# Altium project ADC_ArduinoDue_Shield.PrjPcb
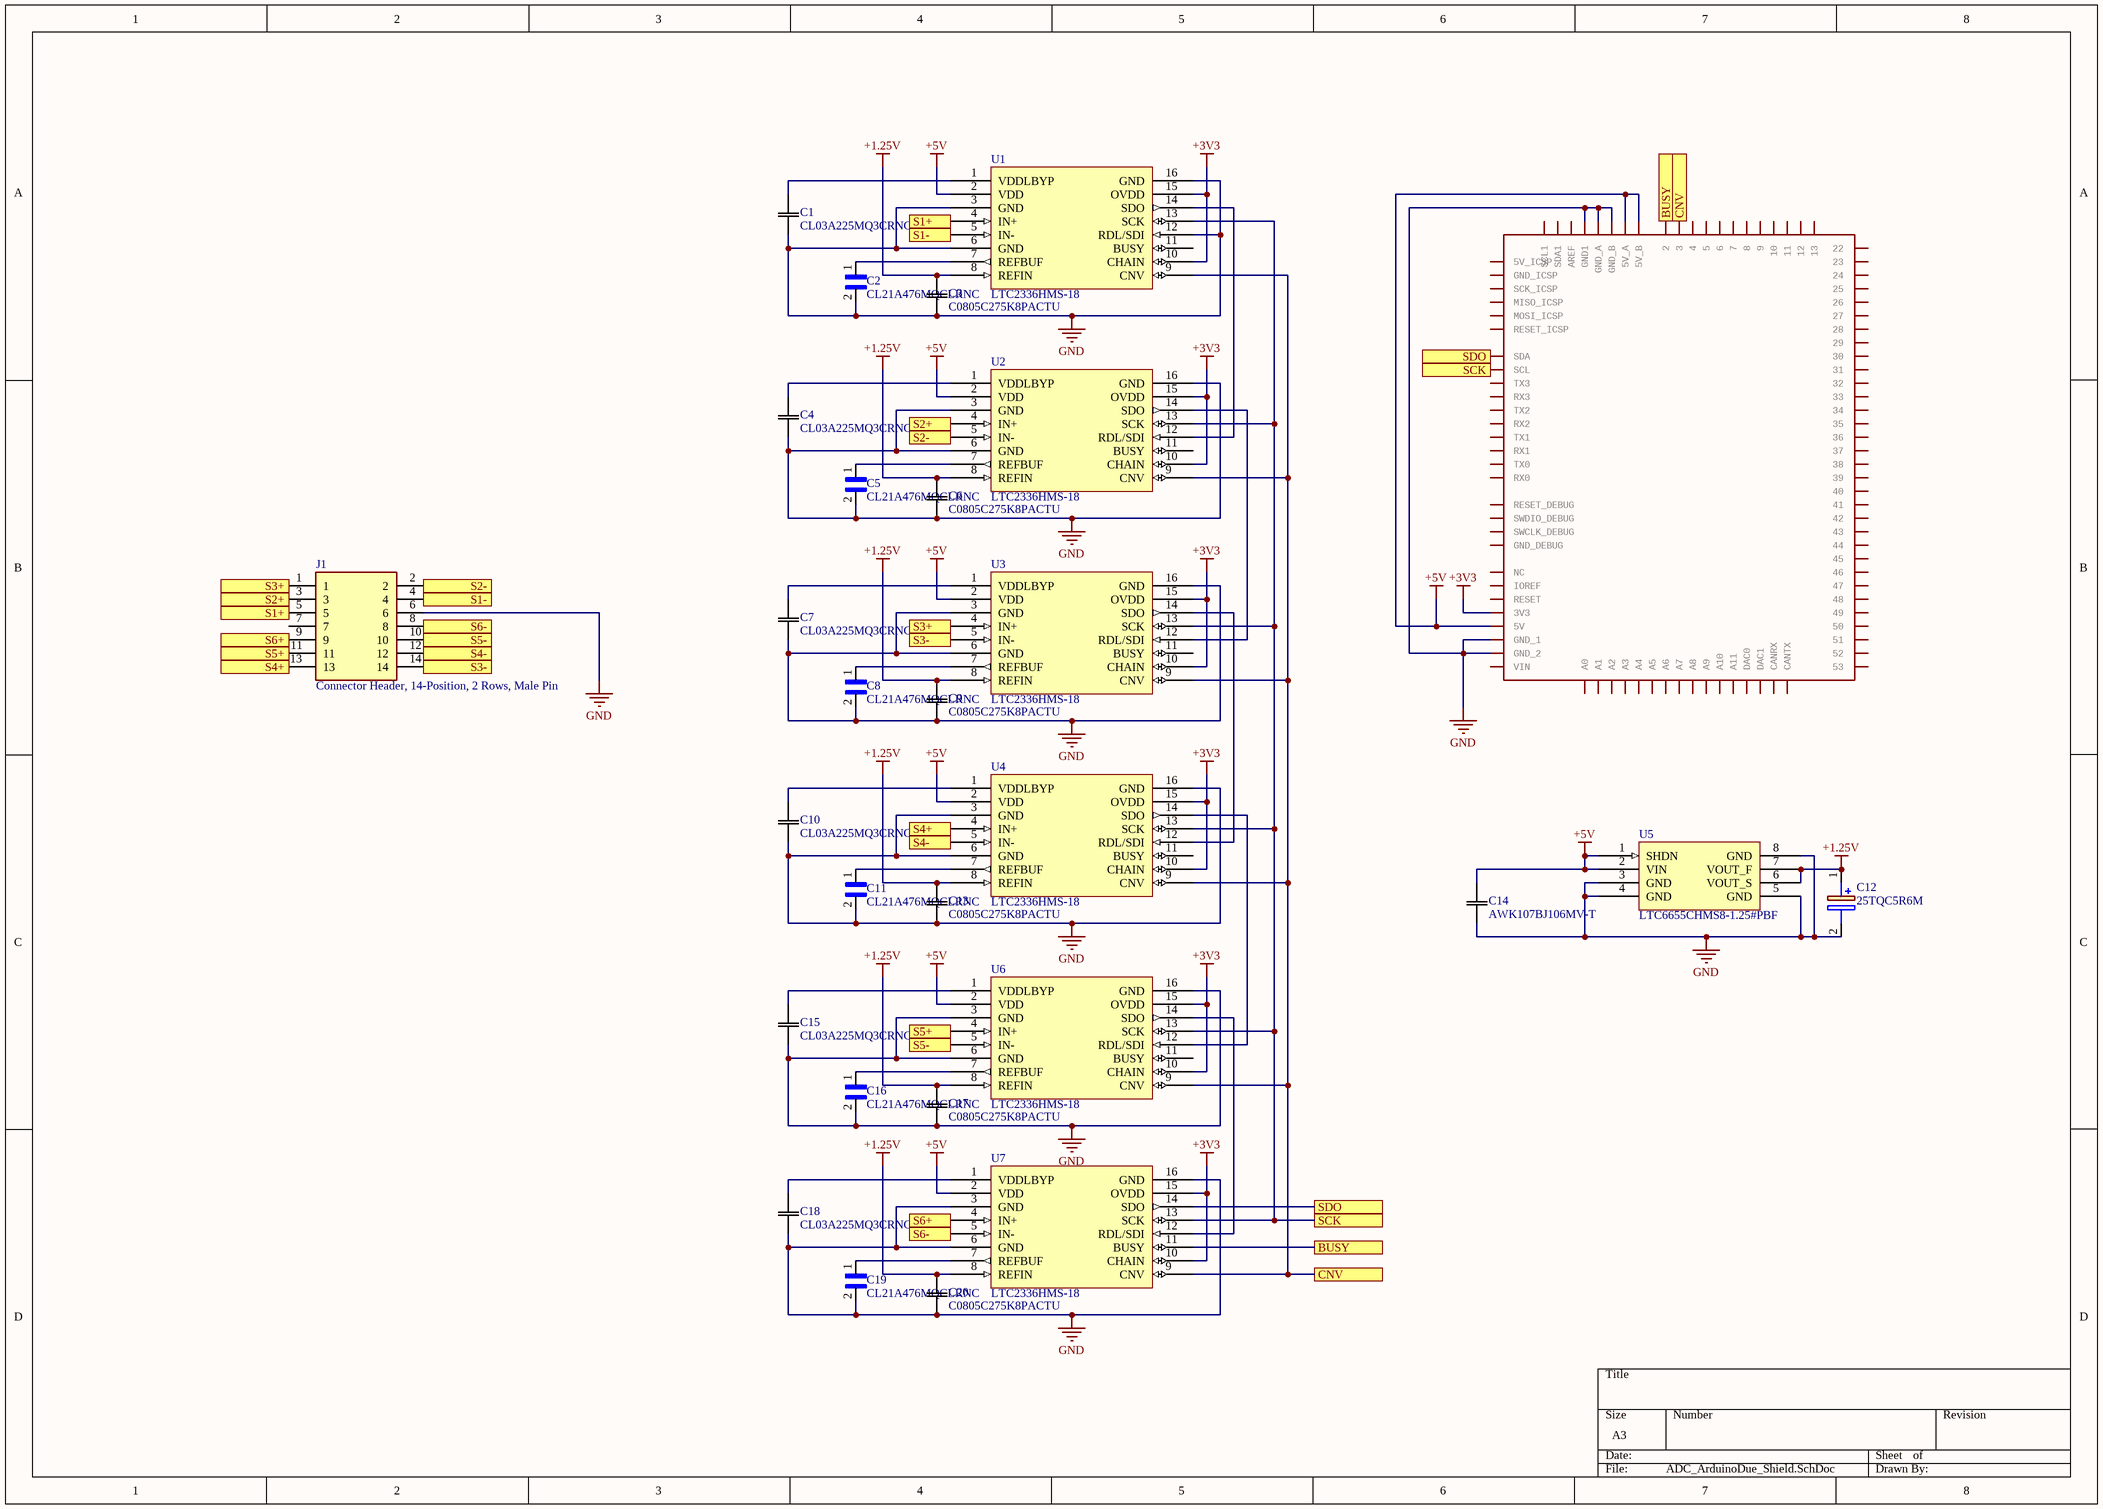
[diagram p0: ADC_ArduinoDue_Shield.SchDoc]
1 sheet, 29 parts. Net scope: flat (ports and power ports of the same name join across sheets).
Board file: ADC_ArduinoDue_Shield.PcbDoc

## Sheet ADC_ArduinoDue_Shield.SchDoc
size A3; SheetNumber: 1; SheetTotal: 1

### Parts
C1  CL03A225MQ3CRNC  [CAP_CL_03_SAM]
C2  CL21A476MQCLRNC  [CAPC2012X140N]
C3  C0805C275K8PACTU  [CAPC220145_105N_KEM]
C4  CL03A225MQ3CRNC  [CAP_CL_03_SAM]
C5  CL21A476MQCLRNC  [CAPC2012X140N]
C6  C0805C275K8PACTU  [CAPC220145_105N_KEM]
C7  CL03A225MQ3CRNC  [CAP_CL_03_SAM]
C8  CL21A476MQCLRNC  [CAPC2012X140N]
C9  C0805C275K8PACTU  [CAPC220145_105N_KEM]
C10  CL03A225MQ3CRNC  [CAP_CL_03_SAM]
C11  CL21A476MQCLRNC  [CAPC2012X140N]
C12  25TQC5R6M  [POSCAP_B1_B1S_B1G_B15G_B2_B2S]
C13  C0805C275K8PACTU  [CAPC220145_105N_KEM]
C14  AWK107BJ106MV-T  [AWK107_0306_TAY]
C15  CL03A225MQ3CRNC  [CAP_CL_03_SAM]
C16  CL21A476MQCLRNC  [CAPC2012X140N]
C17  C0805C275K8PACTU  [CAPC220145_105N_KEM]
C18  CL03A225MQ3CRNC  [CAP_CL_03_SAM]
C19  CL21A476MQCLRNC  [CAPC2012X140N]
C20  C0805C275K8PACTU  [CAPC220145_105N_KEM]
J1  Connector Header, 14-Position, 2 Rows, Male Pin  [TE_1-770973-0]
MCU1  DUE(NORMAL)  [DUE(NORMAL)]  (value not drawn)
U1  LTC2336HMS-18  [TSSOP50P490X110-16N]
U2  LTC2336HMS-18  [TSSOP50P490X110-16N]
U3  LTC2336HMS-18  [TSSOP50P490X110-16N]
U4  LTC2336HMS-18  [TSSOP50P490X110-16N]
U5  LTC6655CHMS8-1.25#PBF  [TSOP65P490X110-8N]
U6  LTC2336HMS-18  [TSSOP50P490X110-16N]
U7  LTC2336HMS-18  [TSSOP50P490X110-16N]

### Ports
BUSY, CNV, S1+, S1-, S2+, S2-, S3+, S3-, S4+, S4-, S5+, S5-, S6+, S6-, SCK, SDO

### Nets
+1.25V: C3.2 C6.2 C9.2 C12.1(+) C13.2 C17.2 C20.2 U1.8(REFIN) U2.8(REFIN) U3.8(REFIN) U4.8(REFIN) U5.6(VOUT_S) U5.7(VOUT_F) U6.8(REFIN) U7.8(REFIN)
+3V3: MCU1.3V3 U1.10(CHAIN) U1.15(OVDD) U2.10(CHAIN) U2.15(OVDD) U3.10(CHAIN) U3.15(OVDD) U4.10(CHAIN) U4.15(OVDD) U6.10(CHAIN) U6.15(OVDD) U7.10(CHAIN) U7.15(OVDD)
+5V: C14.2 MCU1.5V MCU1.5V_A MCU1.5V_B U1.2(VDD) U2.2(VDD) U3.2(VDD) U4.2(VDD) U5.1(SHDN) U5.2(VIN) U6.2(VDD) U7.2(VDD)
GND: C1.1 C2.2 C3.1 C4.1 C5.2 C6.1 C7.1 C8.2 C9.1 C10.1 C11.2 C12.2(-) C13.1 C14.1 C15.1 C16.2 C17.1 C18.1 C19.2 C20.1 J1.6 MCU1.GND1 MCU1.GND_1 MCU1.GND_2 MCU1.GND_A MCU1.GND_B U1.3(GND) U1.6(GND) U1.12(RDL/SDI) U1.16(GND) U2.3(GND) U2.6(GND) U2.16(GND) U3.3(GND) U3.6(GND) U3.16(GND) U4.3(GND) U4.6(GND) U4.16(GND) U5.3(GND) U5.4(GND) U5.5(GND) U5.8(GND) U6.3(GND) U6.6(GND) U6.16(GND) U7.3(GND) U7.6(GND) U7.16(GND)
NetC1_2: C1.2 U1.1(VDDLBYP)
NetC2_1: C2.1 U1.7(REFBUF)
NetC4_2: C4.2 U2.1(VDDLBYP)
NetC5_1: C5.1 U2.7(REFBUF)
NetC7_2: C7.2 U3.1(VDDLBYP)
NetC8_1: C8.1 U3.7(REFBUF)
NetC10_2: C10.2 U4.1(VDDLBYP)
NetC11_1: C11.1 U4.7(REFBUF)
NetC15_2: C15.2 U6.1(VDDLBYP)
NetC16_1: C16.1 U6.7(REFBUF)
NetC18_2: C18.2 U7.1(VDDLBYP)
NetC19_1: C19.1 U7.7(REFBUF)
NetJ1_1: J1.1 U3.4(IN+) ; port S3+
NetJ1_2: J1.2 U2.5(IN-) ; port S2-
NetJ1_3: J1.3 U2.4(IN+) ; port S2+
NetJ1_4: J1.4 U1.5(IN-) ; port S1-
NetJ1_5: J1.5 U1.4(IN+) ; port S1+
NetJ1_8: J1.8 U7.5(IN-) ; port S6-
NetJ1_9: J1.9 U7.4(IN+) ; port S6+
NetJ1_10: J1.10 U6.5(IN-) ; port S5-
NetJ1_11: J1.11 U6.4(IN+) ; port S5+
NetJ1_12: J1.12 U4.5(IN-) ; port S4-
NetJ1_13: J1.13 U4.4(IN+) ; port S4+
NetJ1_14: J1.14 U3.5(IN-) ; port S3-
NetMCU1_2: MCU1.2 U7.11(BUSY) ; port BUSY
NetMCU1_3: MCU1.3 U1.9(CNV) U2.9(CNV) U3.9(CNV) U4.9(CNV) U6.9(CNV) U7.9(CNV) ; port CNV
NetMCU1_SCL: MCU1.SCL U1.13(SCK) U2.13(SCK) U3.13(SCK) U4.13(SCK) U6.13(SCK) U7.13(SCK) ; port SCK
NetMCU1_SDA: MCU1.SDA U7.14(SDO) ; port SDO
NetU1_14: U1.14(SDO) U2.12(RDL/SDI)
NetU2_14: U2.14(SDO) U3.12(RDL/SDI)
NetU3_14: U3.14(SDO) U4.12(RDL/SDI)
NetU4_14: U4.14(SDO) U6.12(RDL/SDI)
NetU6_14: U6.14(SDO) U7.12(RDL/SDI)

Not connected (* = marked no-connect by the designer): J1 7; MCU1 4 5 5V_ICSP 6 7 8 9 10 11 12 13 22 23 24 25 26 27 28 29 30 31 32 33 34 35 36 37 38 39 40 41 42 43 44 45 46 47 48 49 50 51 52 53 A0 A1 A2 A3 A4 A5 A6 A7 A8 A9 A10 A11 AREF CANRX CANTX DAC0 DAC1 GND_DEBUG GND_ICSP IOREF MISO_ICSP MOSI_ICSP NC RESET RESET_DEBUG RESET_ICSP RX0 RX1 RX2 RX3 SCK_ICSP SCL1 SDA1 SWCLK_DEBUG SWDIO_DEBUG TX0 TX1 TX2 TX3 VIN; U1 11(BUSY); U2 11(BUSY); U3 11(BUSY); U4 11(BUSY); U6 11(BUSY)

### Library data of the parts
C1 C4 C7 C10 C15 C18 = CL03A225MQ3CRNC: CL03 Series 0201 2.2 uF 6.3 V X5R ±20% Tolerance Multilayer Ceramic Capacitor; Mfr_Name: Samsung; Type: DEV; Capacitance: 2.2uF; Voltage Rating: 6.3V; Copyright: Copyright (C) 2022 Ultra Librarian. All rights reserved.; Manufacturer_Part_Number: CL03A225MQ3CRNC; Digi-Key_Part_Number_1: 1276-6870-2-ND; Digi-Key_Part_Number_2: 1276-6870-1-ND; Digi-Key_Part_Number_3: 1276-6870-6-ND; RefDes: RefDes; Supplier 1: Digi-Key; Supplier Part Number 1: 1276-6870-1-ND; Manufacturer: Samsung; Manufacturer Part Number: CL03A225MQ3CRNC; RoHS: Yes; Category: Ceramic Capacitors; Stock 1: 667406; Pricing 1: 1=0.27000, 10=0.18500, 50=0.11080, 100=0.09360, 500=0.06406, 1000=0.05667, 2500=0.05421, 5000=0.04928 (USD); Mount: Surface Mount; Case/Package: 0201; Case Code (Metric): 0603; Case Code (Imperial): 0201; Min Operating Temperature: -55°C; Max Operating Temperature: 85°C; Packaging: Tape and Reel; Tolerance: 20%; Dielectric: X5R; Series: CL; Construction: Flat; Length: 0.6mm; Width: 0.012inch; Height: 0.3mm; Thickness: 0.013inch; Depth: 0.3mm; Radiation Hardening: No; RoHS Compliant: Yes; ComponentLink1URL: https://datasheet.ciiva.com/26838/getdatasheetpartid-745303-26838096.pdf?src-supplier=Verical; ComponentLink1Description: https://datasheet.ciiva.com/26838/getdatasheetpartid-745303-26838096.pdf?src-supplier=Verical; Supplier 2: Digi-Key; Supplier Part Number 2: 1276-6870-6-ND; Stock 2: 667406; Pricing 2: 1=0.27000, 10=0.18500, 50=0.11080, 100=0.09360, 500=0.06406, 1000=0.05667, 2500=0.05421, 5000=0.04928 (USD); Supplier 3: Digi-Key; Supplier Part Number 3: 1276-6870-2-ND; Stock 3: 650000; Pricing 3: 10000=0.04682, 20000=0.04435 (USD); Supplier 4: Mouser; Supplier Part Number 4: 187-CL03A225MQ3CRNC; Stock 4: 295762; Pricing 4: 1=0.29000, 10=0.13300, 50=0.13300, 100=0.10000, 1000=0.06100, 10000=0.04900 (USD)
C2 C5 C8 C11 C16 C19 = CL21A476MQCLRNC: Cap Ceramic 47uF 6.3V X5R 20% SMD 0805 85°C Paper T/R; MF: Samsung; Package: 0805 Samsung; MP: CL21A476MQCLRNC; Value: *; SnapEDA_Link: https://www.snapeda.com/parts/CL21A476MQCLRNC/Samsung/view-part/3598165/?ref=snap; Availability: Unavailable; Price: None; DigiKey-Purchase-URL: https://snapeda.com/shop?store=DigiKey&id=3598165; Supplier 1: Digi-Key; Supplier Part Number 1: 1276-2420-1-ND; Manufacturer: Samsung; Manufacturer Part Number: CL21A476MQCLRNC; RoHS: Yes; Category: Ceramic Capacitors; Stock 1: 98057; Pricing 1: 1=0.49000, 10=0.34100, 50=0.23900, 100=0.20480, 500=0.15362, 1000=0.12973 (USD); Mount: Surface Mount; Case/Package: 0805; Case Code (Metric): 2012; Case Code (Imperial): 0805; Contact Plating: Tin; Min Operating Temperature: -55°C; Max Operating Temperature: 85°C; Tolerance: 20%; Packaging: Tape and Reel; Package Quantity: 4000; Capacitance: 47uF; Voltage Rating: 6.3V; Dielectric: X5R; Termination: Wraparound; Series: CL; Construction: Flat; Length: 2mm; Width: 0.049inch; Thickness: 0.037inch; Depth: 1.25mm; Lead Free: Lead Free; RoHS Compliant: Yes; ComponentLink1URL: https://datasheet.ciiva.com/25723/cl21a476mqclrnc-25723991.pdf?src-supplier=Digi-Key; ComponentLink1Description: https://datasheet.ciiva.com/25723/cl21a476mqclrnc-25723991.pdf?src-supplier=Digi-Key; Supplier 2: Digi-Key; Supplier Part Number 2: 1276-2420-6-ND; Stock 2: 98057; Pricing 2: 1=0.49000, 10=0.34100, 50=0.23900, 100=0.20480, 500=0.15362, 1000=0.12973 (USD); Supplier 3: Digi-Key; Supplier Part Number 3: 1276-2420-2-ND; Stock 3: 98057; Pricing 3: 4000=0.11607, 8000=0.10924 (USD); Supplier 4: Mouser; Supplier Part Number 4: 187-CL21A476MQCLRNC; Stock 4: 323; Pricing 4: 1=0.50000, 10=0.28500, 50=0.28500, 100=0.21700, 1000=0.13700, 10000=0.10800 (USD)
C3 C6 C9 C13 C17 C20 = C0805C275K8PACTU: 0805 C 2.7uF Ceramic Multilayer Capacitor; 10 VDC; +85degC; X5R Dielec; +/-10%; Mfr_Name: Kemet; Type: DEV; Tolerance: 10%; Voltage Rating: 10V; Dissipation Factor: 5%; Copyright: Copyright (C) 2022 Ultra Librarian. All rights reserved.; Manufacturer_Part_Number: C0805C275K8PACTU; Digi-Key_Part_Number_1: 399-3127-1-ND; Digi-Key_Part_Number_2: 399-3127-2-ND; Digi-Key_Part_Number_3: 399-3127-6-ND; RefDes: RefDes; Supplier 1: Digi-Key; Supplier Part Number 1: 399-C0805C275K8PAC7800CT-ND; Manufacturer: KEMET; Manufacturer Part Number: C0805C275K8PACTU; RoHS: Yes; Category: Ceramic Capacitors; Stock 1: 7603; Pricing 1: 1=0.51000, 10=0.36000, 50=0.27220, 100=0.23700, 500=0.17556, 1000=0.14923 (USD); Mount: Surface Mount,PCB; Case/Package: 0805; Case Code (Metric): 2012; Case Code (Imperial): 0805; Dielectric Material: Ceramic; Min Operating Temperature: -55°C; Max Operating Temperature: 85°C; Capacitance: 2.7uF; Dielectric: X5R; Packaging: Tape and Reel; Package Quantity: 1; Voltage Rating (DC): 10V; Termination: SMD/SMT; Voltage: 10V; Series: C; Construction: Flat; Length: 2mm; Width: 0.049inch; Height: 3mm; Depth: 1.25mm; Thickness: 0.041inch; Lead Pitch: 0.75mm; Radiation Hardening: No; REACH SVHC: No SVHC; Lead Free: Lead Free; RoHS Compliant: Yes; ComponentLink1URL: http://www.mouser.com/ds/2/212/KEM_C1006_X5R_SMD-1103249.pdf?src-supplier=Mouser; ComponentLink1Description: http://www.mouser.com/ds/2/212/KEM_C1006_X5R_SMD-1103249.pdf?src-supplier=Mouser; ComponentLink2URL: http://components.arrow.com/part/dataview/40912422S7467711N7429?src-supplier=Arrow+Electronics; ComponentLink2Description: http://components.arrow.com/part/dataview/40912422S7467711N7429?src-supplier=Arrow+Electronics; ComponentLink3URL: http://uk.rs-online.com/webdocs/13da/0900766b813da6d7.pdf?src-supplier=RSComponents; ComponentLink3Description: http://uk.rs-online.com/webdocs/13da/0900766b813da6d7.pdf?src-supplier=RSComponents; ComponentLink4URL: http://uk.rs-online.com/webdocs/13da/0900766b813da6d8.pdf?src-supplier=RSComponents; ComponentLink4Description: http://uk.rs-online.com/webdocs/13da/0900766b813da6d8.pdf?src-supplier=RSComponents; ComponentLink5URL: https://www.alliedelec.com/m/d/7f88201dbaab65c95b0b8234579261a3.pdf?src-supplier=Allied+Electronics; ComponentLink5Description: https://www.alliedelec.com/m/d/7f88201dbaab65c95b0b8234579261a3.pdf?src-supplier=Allied+Electronics; ComponentLink6URL: https://www.alliedelec.com/m/d/fc0aaf5de6140bfa85cbf42aaccfae41.pdf?src-supplier=Allied+Electronics; ComponentLink6Description: https://www.alliedelec.com/m/d/fc0aaf5de6140bfa85cbf42aaccfae41.pdf?src-supplier=Allied+Electronics; ComponentLink7URL: https://search.kemet.com/component-edge/download/datasheet/C0805C275K8PACTU.pdf?src-supplier=Digi-Key; ComponentLink7Description: https://search.kemet.com/component-edge/download/datasheet/C0805C275K8PACTU.pdf?src-supplier=Digi-Key; ComponentLink8URL: https://api.kemet.com/component-edge/download/datasheet/C0805C275K8PACTU.pdf?src-supplier=Digi-Key; ComponentLink8Description: https://api.kemet.com/component-edge/download/datasheet/C0805C275K8PACTU.pdf?src-supplier=Digi-Key; ComponentLink9URL: http://capacitoredge.kemet.com/capedge2/DataSheet?pn=C0805C275K8PAC7800&src-supplier=Avnet; ComponentLink9Description: http://capacitoredge.kemet.com/capedge2/DataSheet?pn=C0805C275K8PAC7800&src-supplier=Avnet; ComponentLink10URL: http://capacitoredge.kemet.com/capedge2/DataSheet?pn=C0805C275K8PAC7800&src-supplier=Avnet+Europe; ComponentLink10Description: http://capacitoredge.kemet.com/capedge2/DataSheet?pn=C0805C275K8PAC7800&src-supplier=Avnet+Europe; Supplier 2: Digi-Key; Supplier Part Number 2: 399-C0805C275K8PAC7800DKR-ND; Stock 2: 7603; Pricing 2: 1=0.51000, 10=0.36000, 50=0.27220, 100=0.23700, 500=0.17556, 1000=0.14923 (USD); Supplier 3: Digi-Key; Supplier Part Number 3: 399-C0805C275K8PAC7800TR-ND; Stock 3: 4000; Pricing 3: 4000=0.11970, 8000=0.11172 (USD); Supplier 4: Mouser; Supplier Part Number 4: 80-C0805C275K8P; Stock 4: 6516; Pricing 4: 1=0.51000, 10=0.27300, 50=0.27300, 100=0.22400, 1000=0.14400, 10000=0.11100 (USD)
C12 = 25TQC5R6M: Cap Tant Solid 5.6uF 25V B2 CASE 20% (3.5 X 2.8 X 1.9mm) SMD 3528, B2 0.1 Ohm 105°C Embossed T/R; Manufacturer_Name: Panasonic; ESR (Equivalent Series Resistance): 100mR; Ripple Current: 800mA; Leakage Current: 42uA; Polarity: Polar; Life (Hours): 2000Hour; Dissipation Factor: 10%; Datasheet Link: http://industrial.panasonic.com/cdbs/www-data/pdf/AAA8000/AAA8000C62.pdf; Manufacturer_Part_Number: 25TQC5R6M; Supplier 1: Digi-Key; Supplier Part Number 1: P16518CT-ND; Manufacturer: Panasonic; Manufacturer Part Number: 25TQC5R6M; RoHS: Yes; Category: Tantalum Capacitors; Stock 1: 7710; Pricing 1: 1=2.01000, 10=1.58300, 50=1.37220, 100=1.18740, 500=0.89718, 1000=0.79162 (USD); Mount: Surface Mount; Case/Package: 1411; Number of Pins: 2; Case Code (Metric): 3528; Case Code (Imperial): 1411; Min Operating Temperature: -55°C; Max Operating Temperature: 105°C; Package Quantity: 2000; Packaging: Tape and Reel; Capacitance: 5.6uF; Tolerance: 20%; Voltage Rating: 25V; Voltage Rating (DC): 25V; Termination: SMD/SMT; Voltage: 25V; Features: General Purpose; Length: 3.5mm; Width: 0.11inch; Height: 1.9mm; Height - Seated (Max): 0.079inch; Depth: 2.8mm; Radiation Hardening: No; REACH SVHC: No SVHC; Lead Free: Lead Free; RoHS Compliant: Yes; ComponentLink1URL: https://datasheet.ciiva.com/48675/aaa8000ce14-48675021.pdf?src-supplier=Avnet; ComponentLink1Description: https://datasheet.ciiva.com/48675/aaa8000ce14-48675021.pdf?src-supplier=Avnet; ComponentLink2URL: https://datasheet.ciiva.com/48543/tqc-series-eng-tds-48543112.pdf?src-supplier=Distrelec; ComponentLink2Description: https://datasheet.ciiva.com/48543/tqc-series-eng-tds-48543112.pdf?src-supplier=Distrelec; ComponentLink3URL: https://datasheet.ciiva.com/22745/1734368-22745228.pdf?src-supplier=Element14; ComponentLink3Description: https://datasheet.ciiva.com/22745/1734368-22745228.pdf?src-supplier=Element14; ComponentLink4URL: https://datasheet.ciiva.com/25785/1734368-25785141.pdf?src-supplier=Farnell; ComponentLink4Description: https://datasheet.ciiva.com/25785/1734368-25785141.pdf?src-supplier=Farnell; Supplier 2: Digi-Key; Supplier Part Number 2: P16518DKR-ND; Stock 2: 7710; Pricing 2: 1=2.01000, 10=1.58300, 50=1.37220, 100=1.18740, 500=0.89718, 1000=0.79162 (USD); Supplier 3: Digi-Key; Supplier Part Number 3: P16518TR-ND; Stock 3: 6000; Pricing 3: 2000=0.73885 (USD); Supplier 4: Mouser; Supplier Part Number 4: 667-25TQC5R6M; Stock 4: 2467; Pricing 4: 1=1.77000, 10=1.27000, 50=1.27000, 100=1.08000, 1000=0.72000, 10000=0.67900 (USD)
C14 = AWK107BJ106MV-T: Multilayer Ceramic Capacitor 10uF 4V 20% 0306 Emboss T/R; Mfr_Name: Taiyo Yuden; Type: DEV; Copyright: Copyright (C) 2022 Ultra Librarian. All rights reserved.; Manufacturer_Part_Number: AWK107BJ106MV-T; Digi-Key_Part_Number_1: 587-5159-1-ND; Digi-Key_Part_Number_2: 587-5159-2-ND; Digi-Key_Part_Number_3: 587-5159-6-ND; RefDes: RefDes; Supplier 1: Digi-Key; Supplier Part Number 1: 587-5159-1-ND; Manufacturer: Taiyo Yuden; Manufacturer Part Number: AWK107BJ106MV-T; RoHS: Yes; Category: Ceramic Capacitors; Stock 1: 5653; Pricing 1: 1=0.53000, 10=0.37700, 50=0.28480, 100=0.24810, 500=0.18376, 1000=0.15620 (USD); Mount: Surface Mount; Case/Package: 0306; Case Code (Imperial): 0306; Case Code (Metric): 0816; Min Operating Temperature: -55°C; Max Operating Temperature: 85°C; Packaging: Cut Tape; Capacitance: 10uF; Tolerance: 20%; Voltage Rating: 4V; RoHS Compliant: Yes; ComponentLink1URL: https://ds.yuden.co.jp/TYCOMPAS/ut/detail?pn=AWK107BJ106MV-T &amp;u=M&src-supplier=Digi-Key; ComponentLink1Description: https://ds.yuden.co.jp/TYCOMPAS/ut/detail?pn=AWK107BJ106MV-T &amp;u=M&src-supplier=Digi-Key; ComponentLink2URL: http://ds.yuden.co.jp/TYCOMPAS/ut/detail.do?productNo=AWK107BJ106MV-T&amp;fileName=AWK107BJ106MV-T_SS&amp;mode=specSheetDownload&src-supplier=Digi-Key; ComponentLink2Description: http://ds.yuden.co.jp/TYCOMPAS/ut/detail.do?productNo=AWK107BJ106MV-T&amp;fileName=AWK107BJ106MV-T_SS&amp;mode=specSheetDownload&src-supplier=Digi-Key; Supplier 2: Digi-Key; Supplier Part Number 2: 587-5159-6-ND; Stock 2: 5653; Pricing 2: 1=0.53000, 10=0.37700, 50=0.28480, 100=0.24810, 500=0.18376, 1000=0.15620 (USD); Supplier 3: Digi-Key; Supplier Part Number 3: 587-5159-2-ND; Stock 3: 4000; Pricing 3: 4000=0.13783 (USD); Supplier 4: Mouser; Supplier Part Number 4: 963-AWK107BJ106MV-T; Stock 4: 3076; Pricing 4: 1=0.51000, 10=0.27300, 50=0.27300, 100=0.23800, 1000=0.15000, 10000=0.13100 (USD)
J1 = 1-770973-0: Connector Header, 14-Position, 2 Rows, Male Pin, PCB, White, Mate-N-Lok Series; Manufacturer: TE Connectivity; MF: {'manufacturer': 'TE Connectivity'}; Number of Terminals/Pins: 14; Current Rating: 9.5A; Insulation Resistance: 100MR; Connector System: Wire-to-Board; Mating Alignment: Yes (With); PCB Mount Alignment: No (Without); PCB Mount Retention: With; Max Voltage Rating (AC): 600V; Number of Ports: 1; Test Voltage: 1.5kV; Circuit Application: Power; VDE Tested: Yes; Pitch: 0.162inch; Row Spacing: 0.163inch; Plating Thickness: 8.89um; PCB Thickness: 1.57inch; Approvals: CSA; Value: *; Availability: Unavailable; Package: None; MP: 1-770973-0; Price: None; Supplier 1: Digi-Key; Supplier Part Number 1: A32482-ND; Manufacturer Part Number: 1-770973-0; RoHS: Yes; Category: Power Connectors; Stock 1: 583; Pricing 1: 1=6.69000, 10=6.05100, 100=5.29790, 500=4.46140, 1000=3.90372 (USD); Mount: Through Hole,Board; Color: White; Contact Plating: Tin; Contact Material: Brass; Housing Material: Nylon; Housing Color: White; Min Operating Temperature: -67°C; Max Operating Temperature: 221°C; Packaging: Bag; Package Quantity: 200; Termination: Solder; Orientation: Right Angle; Series: Mini-Universal MATE-N-LOK; Number of Rows: 2; Contact Gender: Male; Number of Positions: 14; Number of Contacts: 14; Connector Type: Pin; Mating Retention: Yes (With); Contact Current Rating: 9.5A; Contact Type: Male Pin; Number of Poles: 14; Fastening Type: Ramp; Voltage Rating: 600V; Contact Retention: No (Without); Number of Power Positions: 14; Sealable: No (Without); Strain Relief: No (Without); Length: 30.56mm; Width: 12.7mm; Height: 11.86mm; Radiation Hardening: No; REACH SVHC: Unknown; Flammability Rating: UL94 V-0; RoHS Compliant: Yes; ComponentLink1URL: https://datasheet.ciiva.com/19460/1963239-19460794.pdf?src-supplier=Jameco; ComponentLink1Description: https://datasheet.ciiva.com/19460/1963239-19460794.pdf?src-supplier=Jameco; ComponentLink2URL: https://datasheet.ciiva.com/1111/eng-cd-770973-g-1111842.pdf?src-supplier=Element14; ComponentLink2Description: https://datasheet.ciiva.com/1111/eng-cd-770973-g-1111842.pdf?src-supplier=Element14; ComponentLink3URL: https://datasheet.ciiva.com/710/eng-cd-770973-h-710742.pdf?src-supplier=Digi-Key; ComponentLink3Description: https://datasheet.ciiva.com/710/eng-cd-770973-h-710742.pdf?src-supplier=Digi-Key; ComponentLink4URL: https://datasheet.ciiva.com/16654/eng-cs-82181-softshell-high-density-0408-16654873.pdf?src-supplier=Avnet+Europe; ComponentLink4Description: https://datasheet.ciiva.com/16654/eng-cs-82181-softshell-high-density-0408-16654873.pdf?src-supplier=Avnet+Europe; Supplier 2: Newark; Supplier Part Number 2: 52K3387; Stock 2: 272; Pricing 2: 1=6.19000, 10=5.42000, 25=5.24000, 50=5.07000, 100=4.89000, 250=4.38000 (USD); Supplier 3: Mouser; Supplier Part Number 3: 571-1-770973-0; Stock 3: 1677; Pricing 3: 1=6.37000, 10=5.58000, 50=5.58000, 100=5.05000, 200=4.51000, 600=4.24000, 1000=3.71000, 2600=3.53000, 5000=3.45000, 10000=3.36000 (USD)
MCU1 = DUE(NORMAL): Mcu, Arduino Due, 32-BIT Cortex- M3 Arm, 96MHZ, 256K, 50K, 5 Spi; Manufacturer Part Number: A000062; GateName_1: G$1; Evaluation Kit: Yes; Number of Bits: 32; SymbolName_1: DUE(NORMAL); LibraryName: DUElib130425; DeviceSetName: DUE(NORMAL); Package: DUE(NORMAL); Supplier 1: Digi-Key; Supplier Part Number 1: 1050-1049-ND; Manufacturer: Arduino; RoHS: Yes; Category: Embedded Processors and Controllers; Stock 1: 7059; Pricing 1: 1=40.30000 (USD); Case/Package: Module; Weight: 0.09lb; Package Quantity: 1; Core Architecture: ARM; Series: AT91SAM3; Length: 4.5inch; Width: 2inch; Height: 0.05inch; REACH SVHC: Unknown; ComponentLink1URL: https://datasheet.ciiva.com/12069/arduinodue-216811-12069710.pdf?src-supplier=Mouser; ComponentLink1Description: https://datasheet.ciiva.com/12069/arduinodue-216811-12069710.pdf?src-supplier=Mouser; ComponentLink2URL: https://datasheet.ciiva.com/14100/due-eng-tds-14100428.pdf?src-supplier=Distrelec; ComponentLink2Description: https://datasheet.ciiva.com/14100/due-eng-tds-14100428.pdf?src-supplier=Distrelec; ComponentLink3URL: https://datasheet.ciiva.com/6205/arduinoduebrd-web-6205279.pdf?src-supplier=Digi-Key; ComponentLink3Description: https://datasheet.ciiva.com/6205/arduinoduebrd-web-6205279.pdf?src-supplier=Digi-Key; ComponentLink4URL: https://datasheet.ciiva.com/19455/2170222-19455450.pdf?src-supplier=Jameco; ComponentLink4Description: https://datasheet.ciiva.com/19455/2170222-19455450.pdf?src-supplier=Jameco; ComponentLink5URL: https://datasheet.ciiva.com/20168/73-4445-20168553.pdf?src-supplier=Rapid+Electronics; ComponentLink5Description: https://datasheet.ciiva.com/20168/73-4445-20168553.pdf?src-supplier=Rapid+Electronics; ComponentLink6URL: https://datasheet.ciiva.com/6810/1682211-6810793.pdf?src-supplier=Newark; ComponentLink6Description: https://datasheet.ciiva.com/6810/1682211-6810793.pdf?src-supplier=Newark; ComponentLink7URL: https://datasheet.ciiva.com/7647/1682211-7647597.pdf?src-supplier=Element14; ComponentLink7Description: https://datasheet.ciiva.com/7647/1682211-7647597.pdf?src-supplier=Element14; Supplier 2: Mouser; Supplier Part Number 2: 782-A000062; Stock 2: 901; Pricing 2: 1=40.30000, 10=40.30000, 50=40.30000, 100=40.30000, 1000=40.30000, 10000=40.30000 (USD)
U1-U4 U6 U7 = LTC2336HMS-18: 1-Channel Single ADC SAR 250ksps 18-bit Serial Automotive 16-Pin MSOP Tube; Manufacturer: Analog Devices / Linear Technology; Manufacturer Part Number: LTC2336HMS-18#PBF; Interface: SPI; Number of Bits: 18; Sampling Rate: 250000S/s; Number of A/D Converters: 1; Min Supply Voltage: 4.75V; Max Supply Voltage: 5.25V; Nominal Supply Current: 5.5mA; Resolution: 18b; Supplier 1: Digi-Key; Supplier Part Number 1: 505-LTC2336HMS-18#PBF-ND; RoHS: Yes; Category: Analog to Digital Converters (ADCs); Stock 1: 51; Pricing 1: 1=51.57000, 10=48.11400, 25=46.09720, 100=44.84700 (USD); Case/Package: MSOP; Number of Pins: 16; Min Operating Temperature: -40°C; Max Operating Temperature: 125°C; Package Quantity: 37; Packaging: Rail/Tube; Number of Inputs: 1; REACH SVHC: No SVHC; RoHS Compliant: Yes; ComponentLink1URL: https://datasheet.ciiva.com/31394/1753492-31394758.pdf?src-supplier=Farnell; ComponentLink1Description: https://datasheet.ciiva.com/31394/1753492-31394758.pdf?src-supplier=Farnell; ComponentLink2URL: https://datasheet.ciiva.com/29654/43771-29654171.pdf?src-supplier=Digi-Key; ComponentLink2Description: https://datasheet.ciiva.com/29654/43771-29654171.pdf?src-supplier=Digi-Key; ComponentLink3URL: https://datasheet.ciiva.com/28464/1753492-28464969.pdf?src-supplier=Element14; ComponentLink3Description: https://datasheet.ciiva.com/28464/1753492-28464969.pdf?src-supplier=Element14
U5 = LTC6655: V-Ref Precision 1.25V 5mA Automotive 8-Pin MSOP (test to see if this pushes to cloud); Manufacturer: Analog Devices / Linear Technology; Tolerance: 0.05%; Number of Channels: 1; Temperature Coefficient: 5ppm/°C; Quiescent Current: 7mA; Reference Type: Series; Supplier 1: Mouser; Manufacturer Part Number: LTC6655CHMS8-1.25#PBF; RoHS: Yes; Category: Voltage Regulators - Linear; Stock 1: 586; Pricing 1: 1=9.85000, 10=8.73000, 50=8.32000, 100=7.22000, 250=6.90000, 1000=6.90000, 10000=6.90000 (USD); Mount: Surface Mount; Case/Package: MSOP; Number of Pins: 8; Min Operating Temperature: -40°C; Max Operating Temperature: 125°C; Package Quantity: 50; Packaging: Rail/Tube; Output Voltage: 1.25V; Nominal Supply Current: 5mA; Output Current: 5mA; Max Output Voltage: 1.25V; Series: -; Supply Current: 5mA; RoHS Compliant: Yes; ComponentLink1URL: https://datasheet.ciiva.com/2006/28576-2006051.pdf?src-supplier=Digi-Key; ComponentLink1Description: https://datasheet.ciiva.com/2006/28576-2006051.pdf?src-supplier=Digi-Key; ComponentLink2URL: https://datasheet.ciiva.com/14152/ltc6655-eng-ds-14152023.pdf?src-supplier=Distrelec; ComponentLink2Description: https://datasheet.ciiva.com/14152/ltc6655-eng-ds-14152023.pdf?src-supplier=Distrelec; Supplier Part Number 1: 584-C6655CHMS81.25PF